# Altium project PCB_Project1.PrjPCB
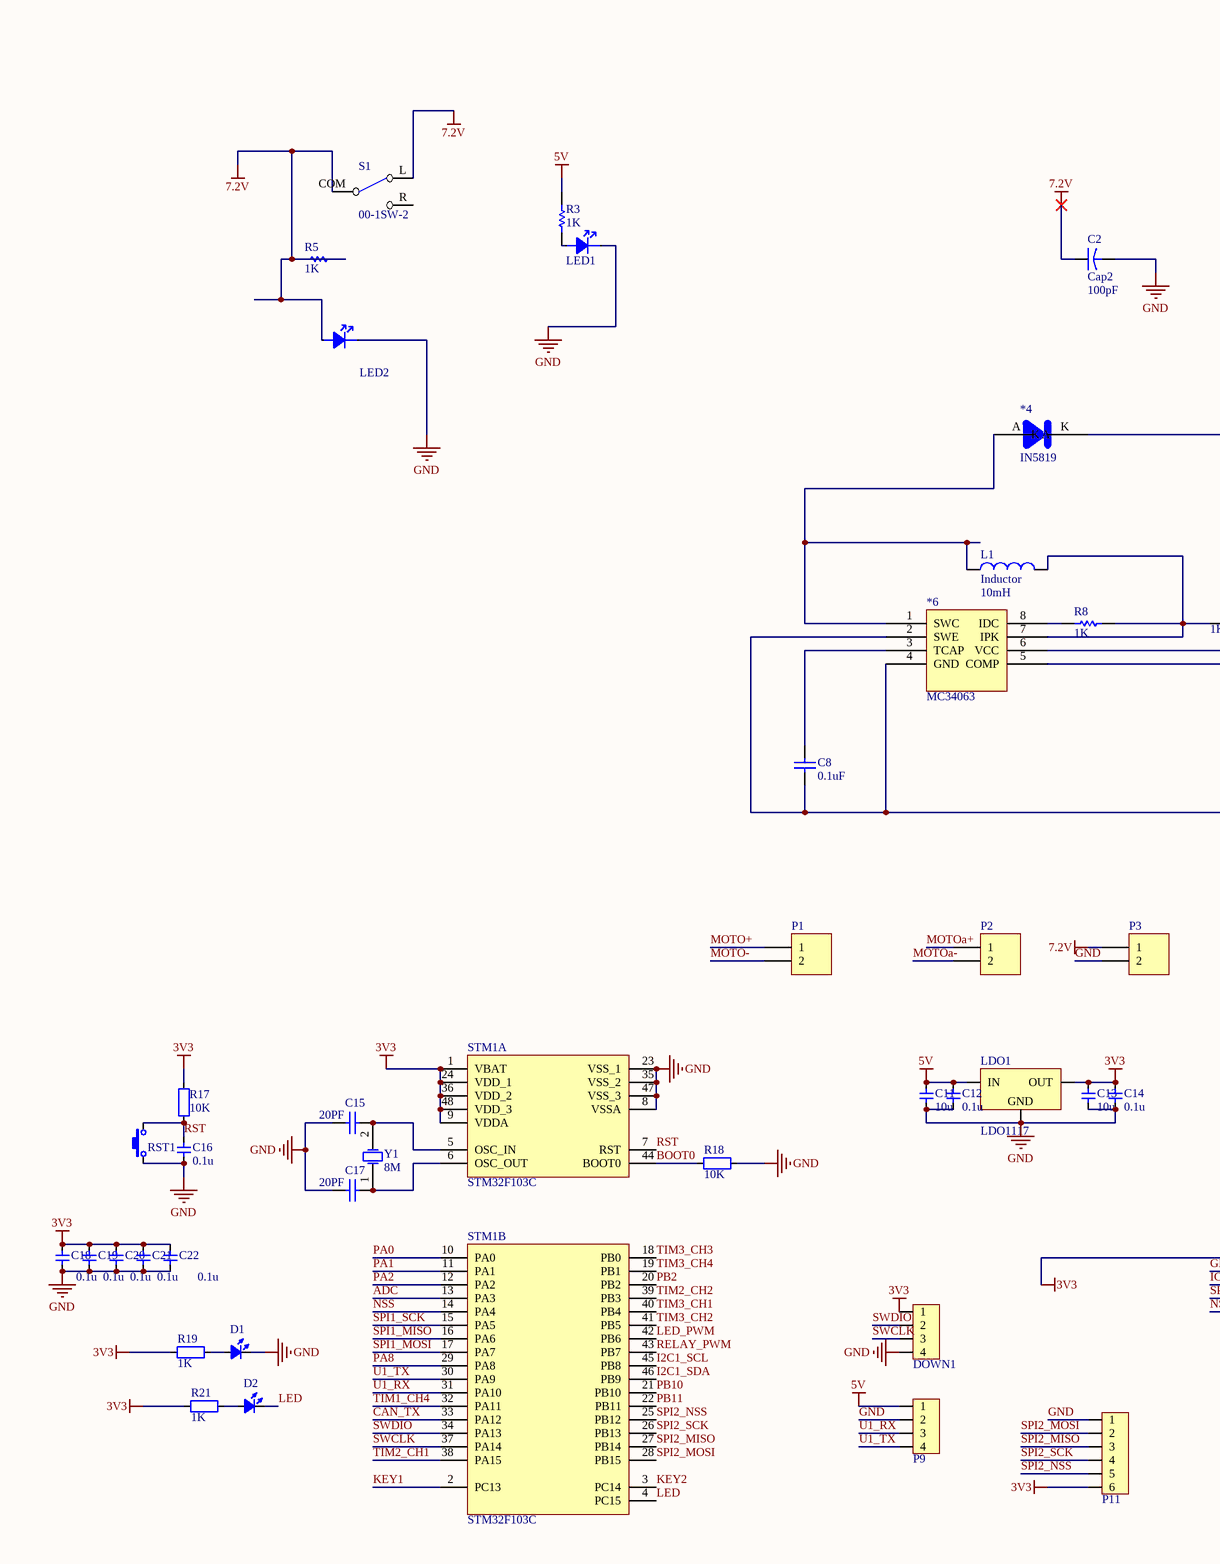
[diagram p0: Sheet1.SchDoc, left]
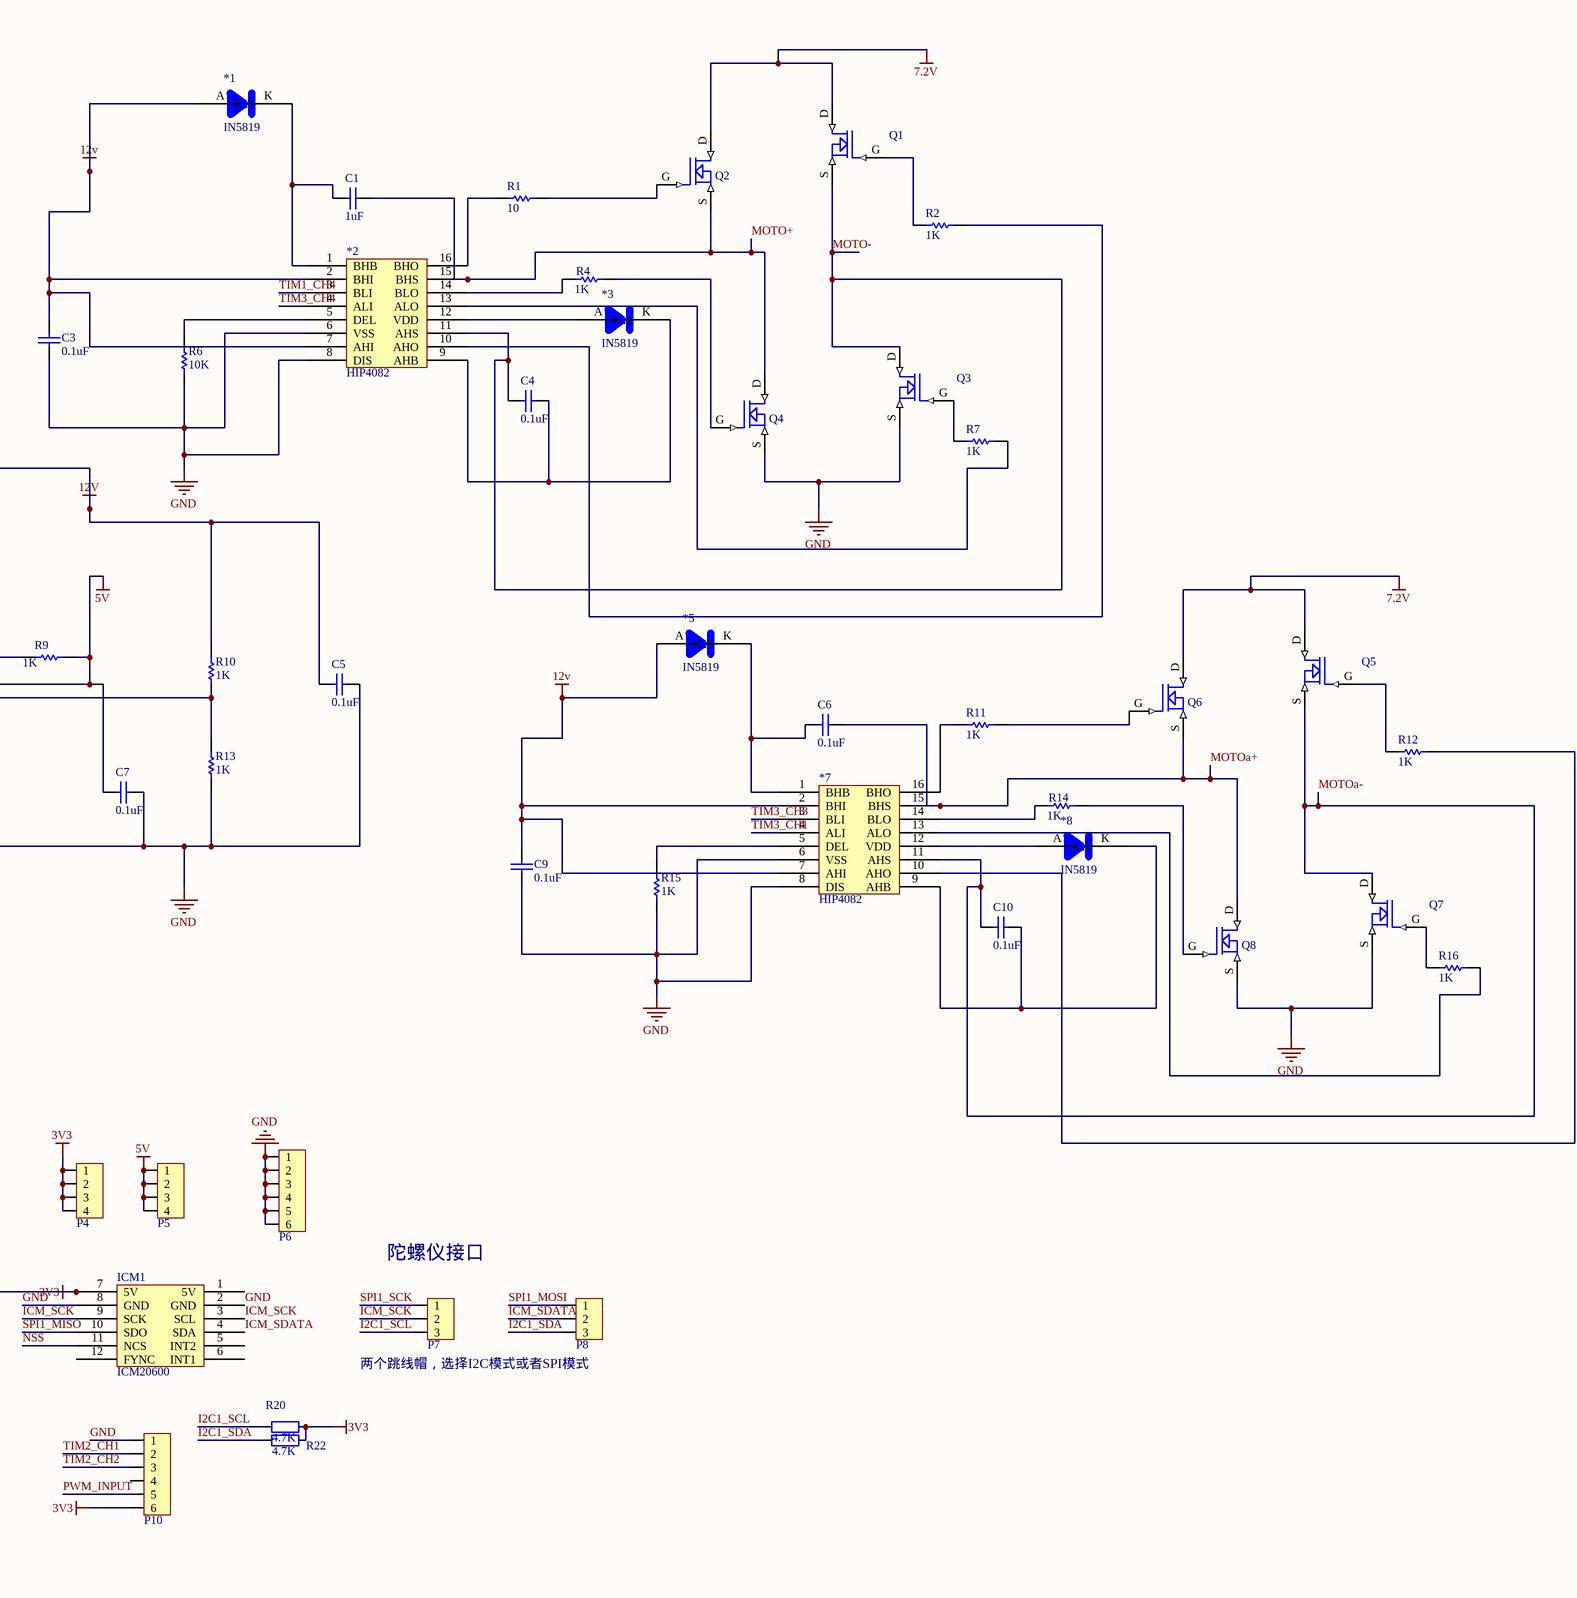
[diagram p1: Sheet1.SchDoc, right]
1 sheet, 83 parts. Net scope: global (net labels, ports and power ports of the same name join across sheets).
Board files: PCB1.PcbDoc, Template_Pcb.PcbDoc

## Sheet Sheet1.SchDoc
size A2

### Parts
*1  IN5819  [0805D]
*2  HIP4082  [SOP_E150_16]
*3  IN5819  [0805D]
*4  IN5819  [0805D]
*5  IN5819  [0805D]
*6  MC34063  [SOIC8]
*7  HIP4082  [SOP_E150_16]
*8  IN5819  [0805D]
C1  value 1uF  [0805C]  (hidden comment: Cap)
C2  Cap2  value 100pF  [CAPR5-4X5]
C3  value 0.1uF  [0805C]  (hidden comment: Cap)
C4  value 0.1uF  [0805C]  (hidden comment: Cap)
C5  value 0.1uF  [0805C]  (hidden comment: Cap)
C6  value 0.1uF  [0805C]  (hidden comment: Cap)
C7  value 0.1uF  [0805C]  (hidden comment: Cap)
C8  value 0.1uF  [0805C]  (hidden comment: Cap)
C9  value 0.1uF  [0805C]  (hidden comment: Cap)
C10  value 0.1uF  [0805C]  (hidden comment: Cap)
C11  value 10u  [CAP_0805]  (hidden comment: CAP_0805)
C12  value 0.1u  [CAP_0805]  (hidden comment: CAP_0805)
C13  value 10u  [CAP_0805]  (hidden comment: CAP_0805)
C14  value 0.1u  [CAP_0805]  (hidden comment: CAP_0805)
C15  value 20PF  [CAP_0805]  (hidden comment: Cap)
C16  value 0.1u  [CAP_0805]  (hidden comment: CAP_0805)
C17  value 20PF  [CAP_0805]  (hidden comment: Cap)
C18  value 0.1u  [CAP_0805]  (hidden comment: CAP_0805)
C19  value 0.1u  [CAP_0805]  (hidden comment: CAP_0805)
C20  value 0.1u  [CAP_0805]  (hidden comment: CAP_0805)
C21  value 0.1u  [CAP_0805]  (hidden comment: CAP_0805)
C22  value 0.1u  [CAP_0805]  (hidden comment: CAP_0805)
D1  LED_0805  [LED_0805_RED]  (value not drawn)
D2  LED_0805  [LED_0805_RED]  (value not drawn)
DOWN1  HDR1x4_2.54  [HDR1x4_2.54_180]  (value not drawn)
ICM1  ICM20600  [ICM20600模块]
L1  Inductor  value 10mH  [0402-A]
LDO1  LDO1117  [SOT223-3]
LED1  lED  [0805D]  (value not drawn)
LED2  lED  [0805D]  (value not drawn)
P1  Header 2  [Green_2P]  (value not drawn)
P2  Header 2  [Green_2P]  (value not drawn)
P3  Header 2  [Green_2P]  (value not drawn)
P4  HDR1x4_2.54  [HDR1x4_2.54_180]  (value not drawn)
P5  HDR1x4_2.54  [HDR1x4_2.54_180]  (value not drawn)
P6  HDR1x6_2.54  [HDR1X6_2.54_180]  (value not drawn)
P7  HDR1x3_2.54  [HDR1X3_2.54_180]  (value not drawn)
P8  HDR1x3_2.54  [HDR1X3_2.54_180]  (value not drawn)
P9  HDR1x4_2.54  [HDR1x4_2.54_180]  (value not drawn)
P10  HDR1x6_2.54  [1.25mm_1X6_SMT]  (value not drawn)
P11  HDR1x6_2.54  [1.25mm_1X6_SMT]  (value not drawn)
Q1  MOSFET N  [NMOS_SOT23]  (value not drawn)
Q2  MOSFET N  [NMOS_SOT23]  (value not drawn)
Q3  MOSFET N  [NMOS_SOT23]  (value not drawn)
Q4  MOSFET N  [NMOS_SOT23]  (value not drawn)
Q5  MOSFET N  [NMOS_SOT23]  (value not drawn)
Q6  MOSFET N  [NMOS_SOT23]  (value not drawn)
Q7  MOSFET N  [NMOS_SOT23]  (value not drawn)
Q8  MOSFET N  [NMOS_SOT23]  (value not drawn)
R1  value 10  [0805R]  (hidden comment: Res1)
R2  value 1K  [0805R]  (hidden comment: Res1)
R3  value 1K  [0805R]  (hidden comment: Res1)
R4  value 1K  [0805R]  (hidden comment: Res1)
R5  value 1K  [0805R]  (hidden comment: Res1)
R6  value 10K  [0805R]  (hidden comment: Res1)
R7  value 1K  [0805R]  (hidden comment: Res1)
R8  value 1K  [0805R]  (hidden comment: Res1)
R9  value 1K  [0805R]  (hidden comment: Res1)
R10  value 1K  [0805R]  (hidden comment: Res1)
R11  value 1K  [0805R]  (hidden comment: Res1)
R12  value 1K  [0805R]  (hidden comment: Res1)
R13  value 1K  [0805R]  (hidden comment: Res1)
R14  value 1K  [0805R]  (hidden comment: Res1)
R15  value 1K  [0805R]  (hidden comment: Res1)
R16  value 1K  [0805R]  (hidden comment: Res1)
R17  value 10K  [RES_0805]  (hidden comment: RES_0805)
R18  value 10K  [RES_0805]  (hidden comment: RES_0805)
R19  value 1K  [RES_0805]  (hidden comment: RES_0805)
R20  value 4.7K  [RES_0805]  (hidden comment: RES_0805)
R21  value 1K  [RES_0805]  (hidden comment: RES_0805)
R22  value 4.7K  [RES_0805]  (hidden comment: RES_0805)
RST1  ButtonTACT_3x6x2.5_180  [ButtonTACT_3x6x2.5_180]  (value not drawn)
S1  00-1SW-2  [单向大开关]
STM1  STM32F103C  [LQFP_P0.5_48]  (parts A,B of 2)
Y1  8M  [Osc-6032]

### Nets
3V3: C13.2 C14.2 C18.2 C19.2 C20.2 C21.2 C22.2 DOWN1.1 ICM1.7(5V) LDO1.2(OUT) P4.1 P4.2 P4.3 P4.4 P10.6 P11.6 R17.2 R19.1 R20.1 R21.1 R22.1 STM1.1(VBAT) STM1.9(VDDA) STM1.24(VDD_1) STM1.36(VDD_2) STM1.48(VDD_3)
5V: *6.6(VCC) C7.2 C11.2 C12.2 LDO1.3(IN) P5.1 P5.2 P5.3 P5.4 P9.1 R3.2 R9.2
7.2V: C2.1 LED2.A P3.1 Q1.D Q2.D Q5.D Q6.D R5.1 R5.2 S1.COM S1.L
12v: *1.A *2.2(BHI) *2.7(AHI) *4.K *5.A *7.2(BHI) *7.7(AHI) C3.2 C5.2 C9.2 R10.2
GND: *2.6(VSS) *2.8(DIS) *6.2(SWE) *6.4(GND) *7.6(VSS) *7.8(DIS) C2.2 C3.1 C5.1 C7.1 C8.2 C9.1 C11.1 C12.1 C13.1 C14.1 C15.1 C16.1 C17.1 C18.1 C19.1 C20.1 C21.1 C22.1 D1.2(K) DOWN1.4 ICM1.2(GND) ICM1.8(GND) LDO1.1(GND) LED1.K LED2.K P3.2 P6.1 P6.2 P6.3 P6.4 P6.5 P6.6 P9.2 P10.1 P11.1 Q3.S Q4.S Q7.S Q8.S R6.1 R13.1 R15.1 R18.2 RST1.1 STM1.8(VSSA) STM1.23(VSS_1) STM1.35(VSS_2) STM1.47(VSS_3)
ADC: STM1.13(PA3)
BOOT0: R18.1 STM1.44(BOOT0)
CAN_TX: STM1.33(PA12)
I2C1_SCL: P7.3 R20.2 STM1.45(PB8)
I2C1_SDA: P8.3 R22.2 STM1.46(PB9)
ICM_SCK: ICM1.3(SCL) ICM1.9(SCK) P7.2
ICM_SDATA: ICM1.4(SDA) P8.2
KEY1: STM1.2(PC13)
KEY2: STM1.3(PC14)
LED: D2.2(K) STM1.4(PC15)
LED_PWM: STM1.42(PB6)
MOTO+: *2.15(BHS) C1.1 P1.1 Q2.S Q4.D
MOTO-: *2.11(AHS) C4.1 P1.2 Q1.S Q3.D
MOTOa+: *7.15(BHS) C6.1 P2.1 Q6.S Q8.D
MOTOa-: *7.11(AHS) C10.1 P2.2 Q5.S Q7.D
NSS: ICM1.11(NCS) STM1.14(PA4)
PA0: STM1.10(PA0)
PA1: STM1.11(PA1)
PA2: STM1.12(PA2)
PA8: STM1.29(PA8)
PB2: STM1.20(PB2)
PB10: STM1.21(PB10)
PB11: STM1.22(PB11)
PWM_INPUT: P10.5
RELAY_PWM: STM1.43(PB7)
RST: C16.2 R17.1 RST1.2 STM1.7(RST)
SPI1_MISO: ICM1.10(SDO) STM1.16(PA6)
SPI1_MOSI: P8.1 STM1.17(PA7)
SPI1_SCK: P7.1 STM1.15(PA5)
SPI2_MISO: P11.3 STM1.27(PB14)
SPI2_MOSI: P11.2 STM1.28(PB15)
SPI2_NSS: P11.5 STM1.25(PB12)
SPI2_SCK: P11.4 STM1.26(PB13)
SWCLK: DOWN1.3 STM1.37(PA14)
SWDIO: DOWN1.2 STM1.34(PA13)
TIM1_CH4: *2.3(BLI) STM1.32(PA11)
TIM2_CH1: P10.2 STM1.38(PA15)
TIM2_CH2: P10.3 STM1.39(PB3)
TIM3_CH1: *7.4(ALI) STM1.40(PB4)
TIM3_CH2: STM1.41(PB5)
TIM3_CH3: *7.3(BLI) STM1.18(PB0)
TIM3_CH4: *2.4(ALI) STM1.19(PB1)
U1_RX: P9.3 STM1.31(PA10)
U1_TX: P9.4 STM1.30(PA9)
Net*1_K: *1.K *2.1(BHB) C1.2
Net*2_5: *2.5(DEL) R6.2
Net*2_9: *2.9(AHB) *3.K C4.2
Net*2_10: *2.10(AHO) R2.2
Net*2_12: *2.12(VDD) *3.A
Net*2_13: *2.13(ALO) R7.2
Net*2_14: *2.14(BLO) R4.1
Net*2_16: *2.16(BHO) R1.1
Net*4_A: *4.A *6.1(SWC) L1.1
Net*5_K: *5.K *7.1(BHB) C6.2
Net*6_3: *6.3(TCAP) C8.1
Net*6_5: *6.5(COMP) R10.1 R13.2
Net*6_7: *6.7(IPK) L1.2 R8.2 R9.1
Net*6_8: *6.8(IDC) R8.1
Net*7_5: *7.5(DEL) R15.2
Net*7_9: *7.9(AHB) *8.K C10.2
Net*7_10: *7.10(AHO) R12.2
Net*7_12: *7.12(VDD) *8.A
Net*7_13: *7.13(ALO) R16.2
Net*7_14: *7.14(BLO) R14.1
Net*7_16: *7.16(BHO) R11.1
NetC15_2: C15.2 STM1.5(OSC_IN) Y1.2(OSC2)
NetC17_2: C17.2 STM1.6(OSC_OUT) Y1.1(OSC1)
NetD1_1: D1.1(A) R19.2
NetD2_1: D2.1(A) R21.2
NetLED1_A: LED1.A R3.1
NetQ1_G: Q1.G R2.1
NetQ2_G: Q2.G R1.2
NetQ3_G: Q3.G R7.1
NetQ4_G: Q4.G R4.2
NetQ5_G: Q5.G R12.1
NetQ6_G: Q6.G R11.2
NetQ7_G: Q7.G R16.1
NetQ8_G: Q8.G R14.2

Not connected (* = marked no-connect by the designer): ICM1 1(5V) 5(INT2) 6(INT1) 12(FYNC); P10 4; S1 R(3)

### Notes on the sheet
- (near P7) 陀螺仪接口
- (near P7) 两个跳线帽，选择I2C模式或者SPI模式

### Library data of the parts
C1 C3-C10 = Cap: Capacitor; Published: 8-Jun-2000; LatestRevisionDate: 17-Jul-2002; LatestRevisionNote: Re-released for DXP Platform.; PackageReference: RAD-0.3; Publisher: Altium Limited
C2 = Cap2: Capacitor; Published: 23-Sep-2002; PackageReference: CAPR5-4X5; Publisher: Altium Limited; PackageDescription: Capacitor; 2 Leads
C11-C14 C16 C18-C22 = Cap_0603: Capacitor
C15 C17 = Cap_1: Capacitor; Published: 8-Jun-2000; LatestRevisionDate: 17-Jul-2002; LatestRevisionNote: Re-released for DXP Platform.; PackageReference: RAD-0.3; Publisher: Altium Limited
D1 D2 = LED_0805: LED
DOWN1 P4 P5 P9 = HDR1x4_2.54: Header
L1 = Inductor: Code_IEC: 1005; Published: 8-Jun-2000; LatestRevisionDate: 29-May-2009; LatestRevisionNote: IPC-7351 Footprint Added.; PackageReference: 0402-A; Publisher: Altium Limited; PackageDescription: Chip Inductor; Code_JEITA: 0402
LDO1 = LDO1117: Power
LED1 LED2 = 00-D-LED
P1-P3 = Header 2: Header, 2-Pin; LatestRevisionDate: 17-Jul-2002; LatestRevisionNote: Re-released for DXP Platform.; Publisher: Altium Limited
P6 P10 P11 = HDR1x6_2.54: Header
P7 P8 = HDR1x3_2.54: Header
R1-R16 = Res1: Resistor; Published: 8-Jun-2000; LatestRevisionDate: 17-Jul-2002; LatestRevisionNote: Re-released for DXP Platform.; PackageReference: AXIAL-0.3; Publisher: Altium Limited
R17-R22 = RES_0805: Resistor
RST1 = ButtonTACT_3x6x2.5_180: Button
S1 = 00-1SW-2_1
STM1 = STM32F103C: MCU
Y1 = C-Osc: Crystal Oscillator; Published: 8-Jun-2000; LatestRevisionDate: 17-Jul-2002; LatestRevisionNote: Re-released for DXP Platform.; PackageReference: R38; Publisher: Altium Limited; PackageDescription: Crystal, Thru-Hole; 2 Leads; Body 3.1 x 8.2 mm (Dia.xH)